# Altium schematic sheet Э3333.SchDoc
size 420 x 297 mm; Address1: Address1; Address2: Address2; Address3: Address3; Address4: Address4; DocumentNumber: АБВГ.123456.001 Э3; SheetNumber: 1; Scale: 1:1; DocumentType: Схема электрическая принципиальная; FirstReferrence: АБВГ.123456.001
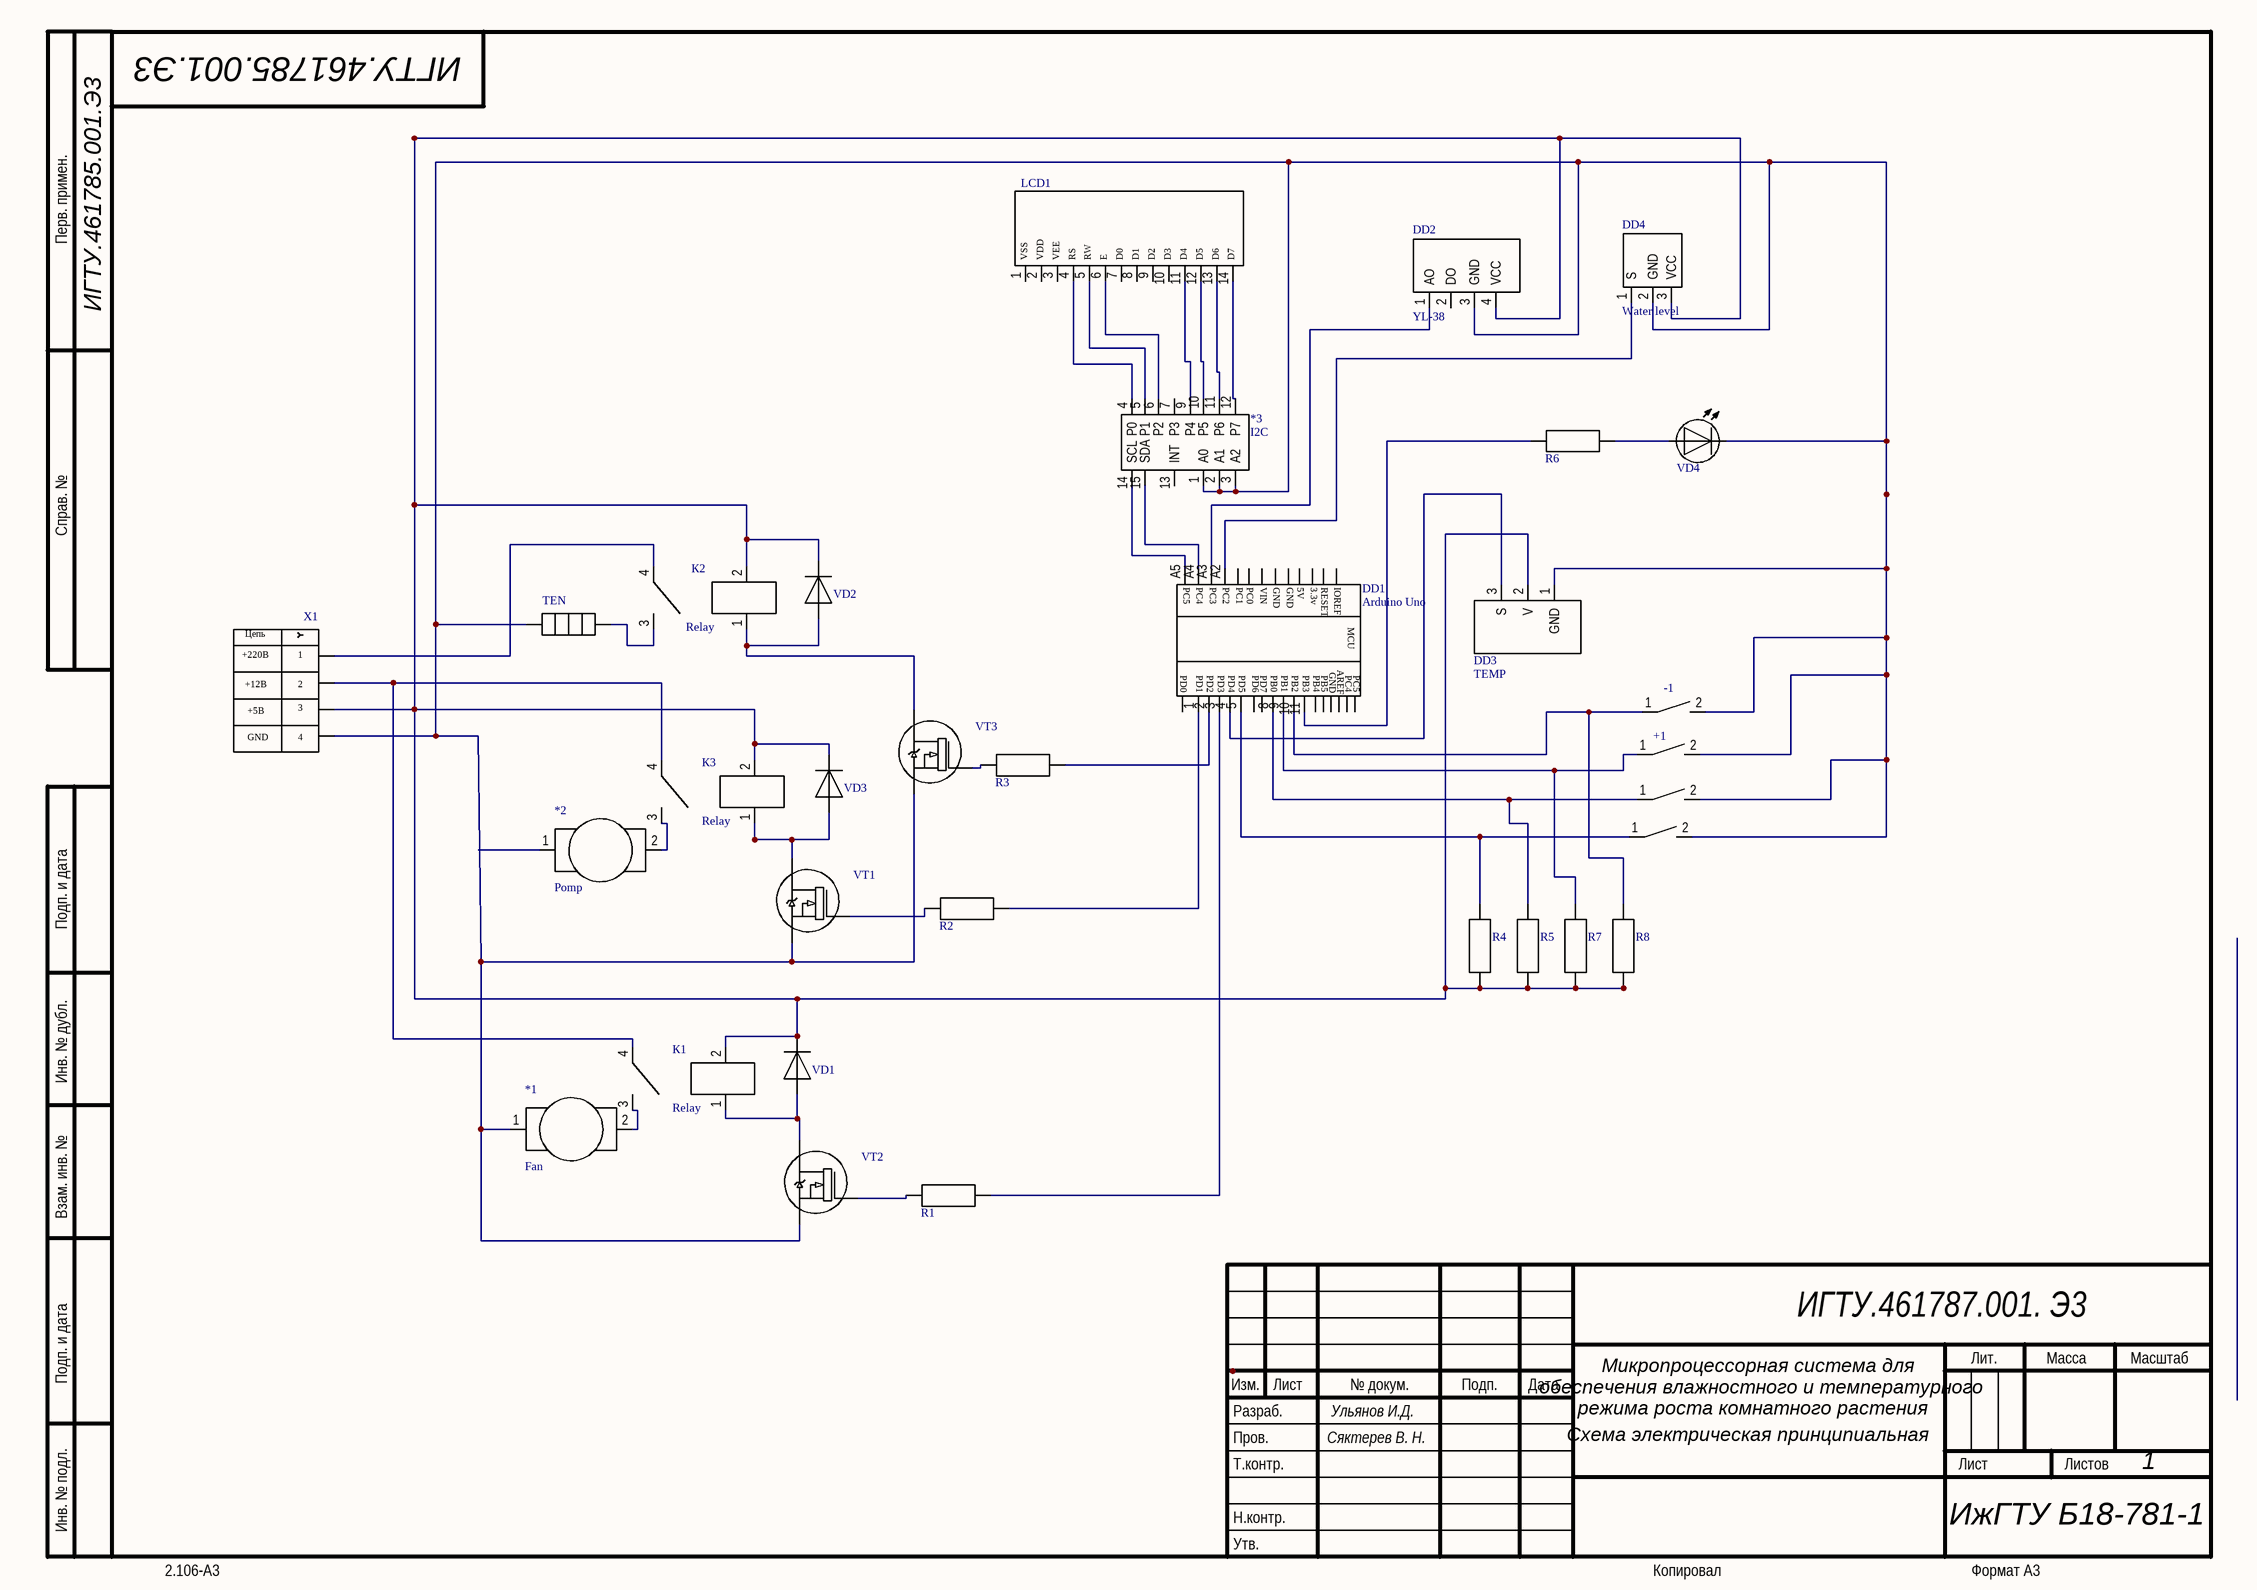
[diagram p0: Э3333.SchDoc]

## Parts
1  Button  [button]  (value not drawn)
*1  Fan
*2  Pomp  [Connector_Clapan]
*3  I2C
*4  Button  [button]  (value not drawn)
+1  Button  [button]  (value not drawn)
-1  Button  [button]  (value not drawn)
DD1  Arduino Uno  [Arduino Uno]
DD2  YL-38
DD3  TEMP  [Connector_temp]
DD4  Water level  [Connector_Level]
LCD1  LCD-DPY  [LCD]  (value not drawn)
R1  Resistor  [Resistor]  (value not drawn)
R2  Resistor  [Resistor]  (value not drawn)
R3  Resistor  [Resistor]  (value not drawn)
R4  Resistor  [Resistor]  (value not drawn)
R5  Resistor  [Resistor]  (value not drawn)
R6  Resistor  [Resistor]  (value not drawn)
R7  Resistor  [Resistor]  (value not drawn)
R8  Resistor  [Resistor]  (value not drawn)
TEN1  TEN  [Connector_TEN]
VD1  Diode  [Diode]  (value not drawn)
VD2  Diode  [Diode]  (value not drawn)
VD3  Diode  [Diode]  (value not drawn)
VD4  LightDiode  [LightDiode]  (value not drawn)
VT1  Transistor  [Transistor]  (value not drawn)
VT2  Transistor  [Transistor]  (value not drawn)
VT3  Transistor  [Transistor]  (value not drawn)
X1  КД105  [PLS2-40]  (value not drawn)
К1  Relay  [Relay]
К2  Relay  [Relay]
К3  Relay  [Relay]

## Nets
+5В: DD1.5
GND: DD1.6
Net1_1: 1.1 DD1.8 R5.2
Net1_2: 1.2 *1.1 *3.1(A0) *3.2(A1) *3.3(A2) *4.2 +1.2 -1.2 DD2.3(GND) DD3.1(GND) DD4.2(GND) TEN1.1 VD4.2 VT1.2(К) VT2.2(К) VT3.2(К) X1.GND
Net*1_2: *1.2 К1.3
Net*2_2: *2.2 К3.3
Net*3_4: *3.4(P0) LCD1.4
Net*3_5: *3.5(P1) LCD1.5
Net*3_6: *3.6(P2) LCD1.6
Net*3_9: *3.9(P4) LCD1.11
Net*3_10: *3.10(P5) LCD1.12
Net*3_11: *3.11(P6) LCD1.13
Net*3_12: *3.12(P7) LCD1.14
Net*3_14: *3.14(SCL) DD1.A5
Net*3_15: *3.15(SDA) DD1.A4
Net*4_1: *4.1 DD1.5 R4.2
Net+1_1: +1.1 DD1.9 R7.2
Net-1_1: -1.1 DD1.10 R8.2
NetDD1_1: DD1.1 R2.2
NetDD1_2: DD1.2 R3.2
NetDD1_3: DD1.3 R1.2
NetDD1_4: DD1.4 DD3.3(S)
NetDD1_11: DD1.11 R6.1
NetDD1_A2: DD1.A2 DD4.1(S)
NetDD1_A3: DD1.A3 DD2.1(AO)
NetDD2_4: DD2.4(VCC) DD3.2(V) DD4.3(VCC) R4.1 R5.1 R7.1 R8.1 VD1.2 VD2.2 VD3.2 X1.+5В К1.2 К2.2 К3.2
NetR1_1: R1.1 VT2.1(Б)
NetR2_1: R2.1 VT1.1(Б)
NetR3_1: R3.1 VT3.1(Б)
NetR6_2: R6.2 VD4.1
NetTEN1_2: TEN1.2 К2.3
NetVD1_1: VD1.1 VT2.3(Э) К1.1
NetVD2_1: VD2.1 VT3.3(Э) К2.1
NetVD3_1: VD3.1 VT1.3(Э) К3.1
NetX1_1: X1.1 К2.4
NetX1_2: X1.2 К1.4 К3.4

Not connected (* = marked no-connect by the designer): *2 1; *3 7(P3) 13(INT); DD1 21 22 27 32 33 34 35 36 37 40 41 42 43 44; DD2 2(DO); LCD1 1 2 3 7 8 9 10

## Notes on the sheet
- ИГТУ.461785.001.Э3
- Перв. примен.
- Справ. №
- Подп. и дата
- Инв. № дубл.
- Взам. инв. №
- ИГТУ.461787.001. Э3
- Разраб.
- Изм.
- Лист
- Ульянов И.Д.
- № докум.
- Подп.
- Дата
- режима роста комнатного растения
- Микропроцессорная система для
- обеспечения влажностного и температурного
- Лит.
- Масса
- Масштаб
- Пров.
- Т.контр.
- Сяктерев В. Н.
- Листов
- 1
- Инв. № подл.
- Утв.
- Н.контр.
- ИжГТУ Б18-781-1
- 2.106-A3
- Копировал
- Формат А3
- (in symbol Connector) Цепь; +220В; +12B
- (in symbol LCD) VSS; VDD; VEE; RS; RW; E; D0; D1; D2; D3; D4; D5; D6; D7
- (in symbol MC) PC5; PC4; PC3; PC2; PC1; PC0; VIN; GND; 5V; 3.3v; RESET; IOREF; MCU; PD0; PD1; PD2; PD3; PD4; PD5; PD6; PD7; PB0; PB1; PB2; PB3; PB4; PB5; AREF

## Library data of the parts
1 *4 +1 -1 = Switch: Кнопка
*2 = Pomp: помпа
DD1 = MC: Микроконтроллер
DD2 = YL-38: Soil m
DD3 = DHT11: Терм
DD4 = Water lever: Уровень воды
LCD1 = LCD: LCD-дисплей
R1-R8 = Resistor: Резистор
TEN1 = ТЭН
VD1-VD3 = Diode: Диод
VD4 = LightDiode: Светодиод
VT1-VT3 = Transistor: Транзистор
X1 = Connector: Разъем
К1-К3 = Relay: Реле